# Altium schematic sheet Alarm_Sch_1.SchDoc: Alarm Clock
size A4; DrawnBy: Saliya Dinusha; DocumentNumber: 1; Revision: 1; SheetNumber: 1; SheetTotal: 1; TotalNumber: 1
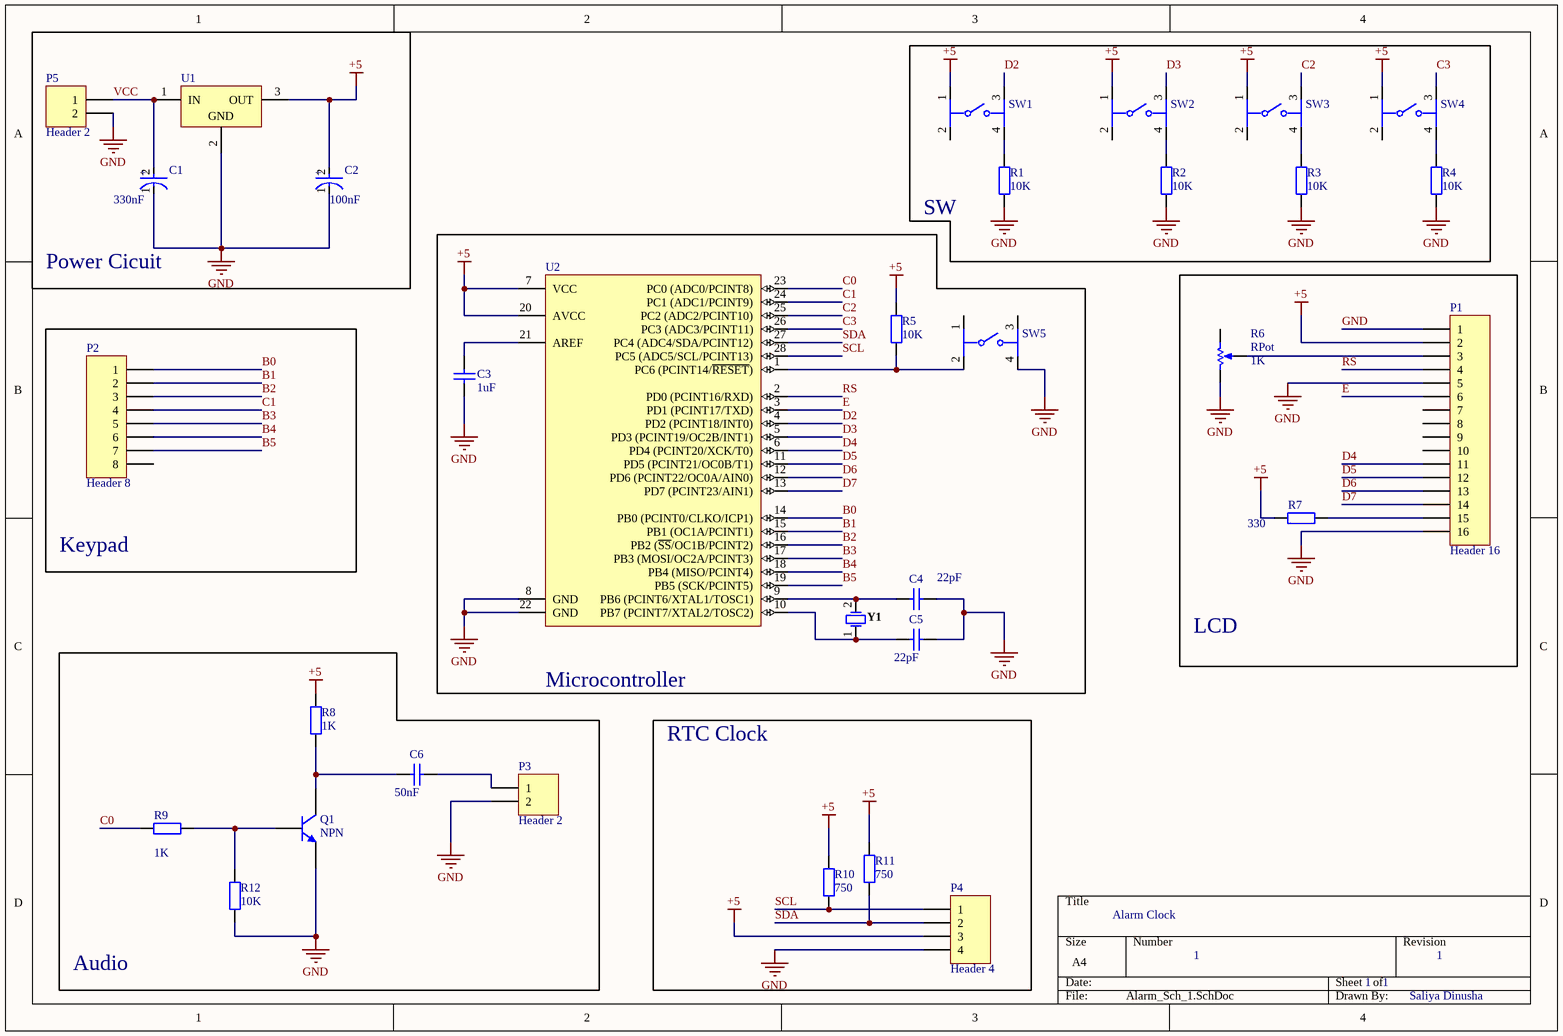
[diagram p0: Alarm_Sch_1.SchDoc]

## Parts
C1  Capacitance: 330nF  [FP-UVR2AR22MDD1TD-MFG]  (hidden comment: UVR2AR22MDD1TD)
C2  Capacitance: 100nF  [FP-UVR2AR22MDD1TD-MFG]  (hidden comment: UVR2AR22MDD1TD)
C3  value 1uF  [KEMT-C315-THT-2]  (hidden comment: C315C103K1R5TA)
C4  value 22pF  [KEMT-C315-THT-2]  (hidden comment: C315C103K1R5TA)
C5  value 22pF  [KEMT-C315-THT-2]  (hidden comment: C315C103K1R5TA)
C6  value 50nF  [KEMT-C315-THT-2]  (hidden comment: C315C103K1R5TA)
P1  Header 16  [HDR1X16]
P2  Header 8  [HDR1X8]
P3  Header 2  [HDR1X2]
P4  Header 4  [HDR1X4]
P5  Header 2  [HDR1X2]
Q1  NPN  [TO-226-AA]
R1  value 10K  [AXIAL-0.4]  (hidden comment: Res2)
R2  value 10K  [AXIAL-0.4]  (hidden comment: Res2)
R3  value 10K  [AXIAL-0.4]  (hidden comment: Res2)
R4  value 10K  [AXIAL-0.4]  (hidden comment: Res2)
R5  value 10K  [AXIAL-0.4]  (hidden comment: Res2)
R6  RPot  value 1K  [VR5]
R7  value 330  [AXIAL-0.4]  (hidden comment: Res2)
R8  value 1K  [AXIAL-0.4]  (hidden comment: Res2)
R9  value 1K  [AXIAL-0.4]  (hidden comment: Res2)
R10  value 750  [AXIAL-0.4]  (hidden comment: Res2)
R11  value 750  [AXIAL-0.4]  (hidden comment: Res2)
R12  value 10K  [AXIAL-0.4]  (hidden comment: Res2)
SW1  1-1825910-0  [FP-1-1825910-0-MFG]  (value not drawn)
SW2  1-1825910-0  [FP-1-1825910-0-MFG]  (value not drawn)
SW3  1-1825910-0  [FP-1-1825910-0-MFG]  (value not drawn)
SW4  1-1825910-0  [FP-1-1825910-0-MFG]  (value not drawn)
SW5  1-1825910-0  [FP-1-1825910-0-MFG]  (value not drawn)
U1  L7805CV  [TO220]  (value not drawn)
U2  ATmega328-PU  [28P3]  (value not drawn)
Y1  FOXSLF/160-20  [FOX-FOXSLF160-20]  (value not drawn)

## Blocks framed on the sheet
Power Cicuit: C1 C2 P5 U1
SW: R1-R4 SW1-SW4
Microcontroller: C3-C5 R5 SW5 U2 Y1
LCD: P1 R6 R7
Keypad: P2
Audio: C6 P3 Q1 R8 R9 R12
RTC Clock: P4 R10 R11

## Nets
+5: C2.2(A) P1.2 P4.3 R5.2 R7.1 R8.2 R10.2 R11.2 SW1.1 SW2.1 SW3.1 SW4.1 U1.3(OUT) U2.7(VCC) U2.20(AVCC)
GND: C1.1(C) C2.1(C) C3.1 C4.2 C5.2 P1.1 P1.5 P1.16 P3.2 P4.4 P5.2 Q1.3(E) R1.1 R2.1 R3.1 R4.1 R6.2(BOT) R12.1 SW5.4 U1.2(GND) U2.8(GND) U2.22(GND)
B0: P2.1 U2.14(PB0_(PCINT0/CLKO/ICP1))
B1: P2.2 U2.15(PB1_(OC1A/PCINT1))
B2: P2.3 U2.16(PB2_(~{SS}/OC1B/PCINT2))
B3: P2.5 U2.17(PB3_(MOSI/OC2A/PCINT3))
B4: P2.6 U2.18(PB4_(MISO/PCINT4))
B5: P2.7 U2.19(PB5_(SCK/PCINT5))
C0: R9.1 U2.23(PC0_(ADC0/PCINT8))
C1: P2.4 U2.24(PC1_(ADC1/PCINT9))
C2: SW3.3 U2.25(PC2_(ADC2/PCINT10))
C3: SW4.3 U2.26(PC3_(ADC3/PCINT11))
D2: SW1.3 U2.4(PD2_(PCINT18/INT0))
D3: SW2.3 U2.5(PD3_(PCINT19/OC2B/INT1))
D4: P1.11 U2.6(PD4_(PCINT20/XCK/T0))
D5: P1.12 U2.11(PD5_(PCINT21/OC0B/T1))
D6: P1.13 U2.12(PD6_(PCINT22/OC0A/AIN0))
D7: P1.14 U2.13(PD7_(PCINT23/AIN1))
E: P1.6 U2.3(PD1_(PCINT17/TXD))
RS: P1.4 U2.2(PD0_(PCINT16/RXD))
SCL: P4.1 R10.1 U2.28(PC5_(ADC5/SCL/PCINT13))
SDA: P4.2 R11.1 U2.27(PC4_(ADC4/SDA/PCINT12))
VCC: C1.2(A) P5.1 U1.1(IN)
NetC3_2: C3.2 U2.21(AREF)
NetC4_1: C4.1 U2.9(PB6_(PCINT6/XTAL1/TOSC1)) Y1.2
NetC5_1: C5.1 U2.10(PB7_(PCINT7/XTAL2/TOSC2)) Y1.1
NetC6_1: C6.1 Q1.1(C) R8.1
NetC6_2: C6.2 P3.1
NetP1_3: P1.3 R6.3(TAP)
NetP1_15: P1.15 R7.2
NetQ1_2: Q1.2(B) R9.2 R12.2
NetR1_2: R1.2 SW1.4
NetR2_2: R2.2 SW2.4
NetR3_2: R3.2 SW3.4
NetR4_2: R4.2 SW4.4
NetR5_1: R5.1 SW5.2 U2.1(PC6_(PCINT14/~{RESET}))

Not connected (* = marked no-connect by the designer): P1 7 8 9 10; P2 8; R6 1(TOP); SW1 2; SW2 2; SW3 2; SW4 2; SW5 1 3

## Notes on the sheet
- (in symbol CMP-12462-000035-1) +

## Library data of the parts
C1 C2 = CMP-12462-000035-1: CAP ALUM 0.22UF 20% 100V RADIAL; Ripple Current: 4.7mA; Life (Hours): 2000Hour; Dielectric Material: Aluminium; Dissipation Factor: 0.08%; Lead/Base Style: Straight; Series: VR; Length: 11mm; Package Quantity: 2000; Height - Seated (Max): 0.492inch; Termination: Radial; Height: 11mm; Tolerance: 20%; Voltage Rating (DC): 100V; Min Operating Temperature: -40°C; Voltage Rating: 100V; RoHS Compliant: Yes; Mount: Through Hole; REACH SVHC: No SVHC; Case/Package: Radial; Diameter: 5mm; Packaging: Tape and Reel; Lead Pitch: 2mm; Max Operating Temperature: 85°C
C3-C6 = CMP-1664-00007-1: Capacitor, Ceramic, 0.01 uF, +/- 10%, 100 V, X7R, -55 to 125 degC, 2-Pin THD, RoHS, Bulk; Output Voltage: 70 V; Case\Package: PDIP; Forward Current: 60 mA; Nominal Vf: 1.3 V; Forward Voltage: 1.5 V; Channels: 2; Max Power Dissipation: 400 mW; Vce Max: 500 mV; ComponentLink1Description: Manufacturer URL; ComponentLink2Description: Datasheet; Packaging: Rail/Tube; RoHSCompliant: true; Package Quantity: 2000; PackageReference: C315-THT-2; Min Operating Temperature: -55 degC; Max Operating Temperature: 100 degC; Radiation Hardening: No; ComponentLink1URL: http://www.kemet.com/; DatasheetVersion: Aug-16; Pins: 16; PackageDescription: 2-Pin Through Hole Device, Body 3.81 x 2.54 mm; REACH SVHC: Unknown; Mount: Through Hole; ComponentLink2URL: http://capacitoredge.kemet.com/capedge2/DataSheet/Datasheet-C315C103K1R5TA.pdf?pn=C315C103K1R5TA{BULK}
P1 = Header 16: Header, 16-Pin; LatestRevisionDate: 17-Jul-2002; LatestRevisionNote: Re-released for DXP Platform.; Publisher: Altium Limited
P2 = Header 8: Header, 8-Pin; LatestRevisionDate: 17-Jul-2002; LatestRevisionNote: Re-released for DXP Platform.; Publisher: Altium Limited
P3 P5 = Header 2: Header, 2-Pin; LatestRevisionDate: 17-Jul-2002; LatestRevisionNote: Re-released for DXP Platform.; Publisher: Altium Limited
P4 = Header 4: Header, 4-Pin; LatestRevisionDate: 17-Jul-2002; LatestRevisionNote: Re-released for DXP Platform.; Publisher: Altium Limited
Q1 = NPN: NPN Bipolar Transistor; Published: 8-Jun-2000; LatestRevisionDate: 17-Jul-2002; LatestRevisionNote: Re-released for DXP Platform.; PackageReference: TO-226-AA; Publisher: Altium Limited; PackageDescription: TO, Flat Index; 3 In-Line, Axial Leads; Body Dia. 4.8mm; Leads 0.55 x 0.51 mm (max); Code_JEDEC: TO-226-AA
R1-R5 R7-R12 = Res2: Resistor; Published: 8-Jun-2000; LatestRevisionDate: 17-Jul-2002; LatestRevisionNote: Re-released for DXP Platform.; PackageReference: AXIAL-0.4; Publisher: Altium Limited; PackageDescription: Axial Device, Thru-Hole; 2 Leads; 0.4 in Pin Spacing
R6 = RPot: Potentiometer; Sim Note: Enter the Resistance value and the set point into parameter fields.; Set Position: 0.5; Published: 8-Jun-2000; LatestRevisionDate: 17-Jul-2002; LatestRevisionNote: Re-released for DXP Platform.; PackageReference: VR5; Publisher: Altium Limited; PackageDescription: Variable Resistor, Thru-Hole; 3 Leads
SW1-SW5 = CMP-03407-000018-1: SWITCH TACTILE SPST-NO 0.05A 24V; Switch Function: Off-Mom; Mechanical Life: 100000Cycles; Actuator Material: Nylon; Actuator Color: Blue; Contact Current Rating: 50mA; Illumination Type: Non-Illuminated; Throw Configuration: SPST; Actuator Length: 3.4mm; Operating Force: 1.56N; Actuator Type: Standard; Contact Resistance: 100mR; Switch Travel: 0.25mm; Depth: 5.99mm; Contact Plating: Silver; Max Operating Temperature: 85°C; Electrical Life: 100000Cycles; Min Operating Temperature: -35°C; RoHS Compliant: Yes; Max Voltage Rating (DC): 24V; Mount: Through Hole; Packaging: Loose Piece; Length: 5.99mm; Series: FSMJ, Alcoswitch; Orientation: Straight; Contact Material: Brass; Radiation Hardening: No; Package Quantity: 750; Max Current Rating: 50mA; Termination: PC Pins; Type: Switch; Voltage Rating (DC): 24V
U1 = CMP-0244-00483-1: Positive Voltage Regulator, 5V, 3-Pin TO-220; PackageDescription: TO, Thru-Hole, Vertical, Heatsink Mounted; 3 In-Line Leads; Pitch 2.54 mm; ComponentLink2Description: Datasheet; PackageReference: TO220; ComponentLink3URL: http://www.st.com/internet/com/TECHNICAL_RESOURCES/TECHNICAL_LITERATURE/PACKAGE_INFORMATION/CD00004649.pdf; DatasheetVersion: 16/11/2011; ComponentLink1Description: Manufacturer URL; ComponentLink1URL: http://www.st.com; PackageVersion: ver3.0; ComponentLink3Description: Package Specification; ComponentLink2URL: http://www.st.com/internet/com/TECHNICAL_RESOURCES/TECHNICAL_LITERATURE/DATASHEET/CD00000444.pdf
U2 = CMP-0095-00015-2: 8-bit AVR Microcontroller, 32KB Flash, 1KB EEPROM, 2KB SRAM, 28-pin PDIP, Industrial Grade (-40°C to 85°C); ComponentLink3Description: ATmega48A/48PA/88A/88PA/168A/168PA/328/328P Summary; RevisionNote: DatasheetVersion updated. URLs added.; DatasheetVersion: revD, May-2011; ComponentLink1URL: http://www.atmel.com/; PackageVersion: revB, Sep-2001; PackageDescription: 28-lead (0.300"/7.62mm Wide) Plastic Dual Inline Package (PDIP); PackageReference: 28P3; ComponentLink1Description: Manufacturer URL; ComponentLink2Description: ATmega48A/48PA/88A/88PA/168A/168PA/328/328P Datasheet; ComponentLink3URL: http://www.atmel.com/dyn/resources/prod_documents/8271S.pdf; ComponentLink2URL: http://www.atmel.com/dyn/resources/prod_documents/8271.pdf
Y1 = CMP-1749-00003-1: Resistance Weld Thru-Hole Crystal, 16 MHz, -20 to 70 degC, 2-Pin THD, RoHS, Bulk; Voltage Rating: 250 V; Tolerance: 1%; Resistance: 221 kohm; Case\Package: Axial; Power Rating: 250 mW; RoHSCompliant: true; Package Quantity: 200; Packaging: Bulk; Min Operating Temperature: -55 degC; DatasheetVersion: Mar-15; ComponentLink1URL: http://www.foxonline.com/; Max Operating Temperature: 155 degC; PackageReference: FOXSLF160-20; Mount: Through Hole; PackageDescription: 2-Pin Through Hole Device, Body 11.35 x 4.65 mm; ComponentLink1Description: Manufacturer URL; ComponentLink2URL: http://www.foxonline.com/pdfs/hc49slf.pdf; ComponentLink2Description: Datasheet; Length: 0.248 inch